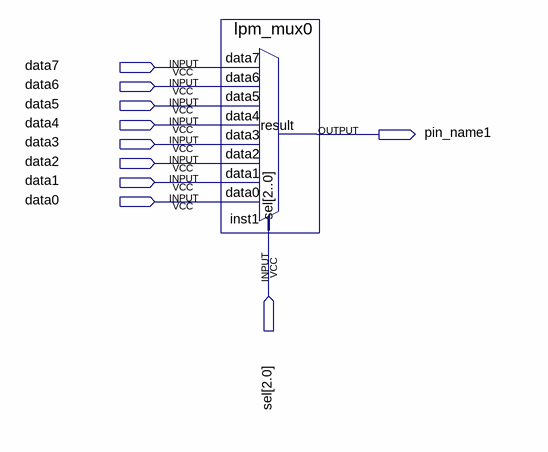
[diagram p0: schematic sheet]
// Quartus schematic balandin_vladislav_5.bdf as structural Verilog: 1 symbols, 10 pins
module balandin_vladislav_5 (
  input  data7,
  input  data6,
  input  data5,
  input  data4,
  input  data3,
  input  data2,
  input  data1,
  input  data0,
  input  \sel[2.0] ,
  output pin_name1
);

  lpm_mux0 inst1 (
    .data7(data7), .data6(data6), .data5(data5), .data4(data4), .data3(data3), .data2(data2), .data1(data1),
    .data0(data0), .sel({3{\sel[2.0] }}), .result(pin_name1));
endmodule
